# Altium project EV76_MB.PrjPcb
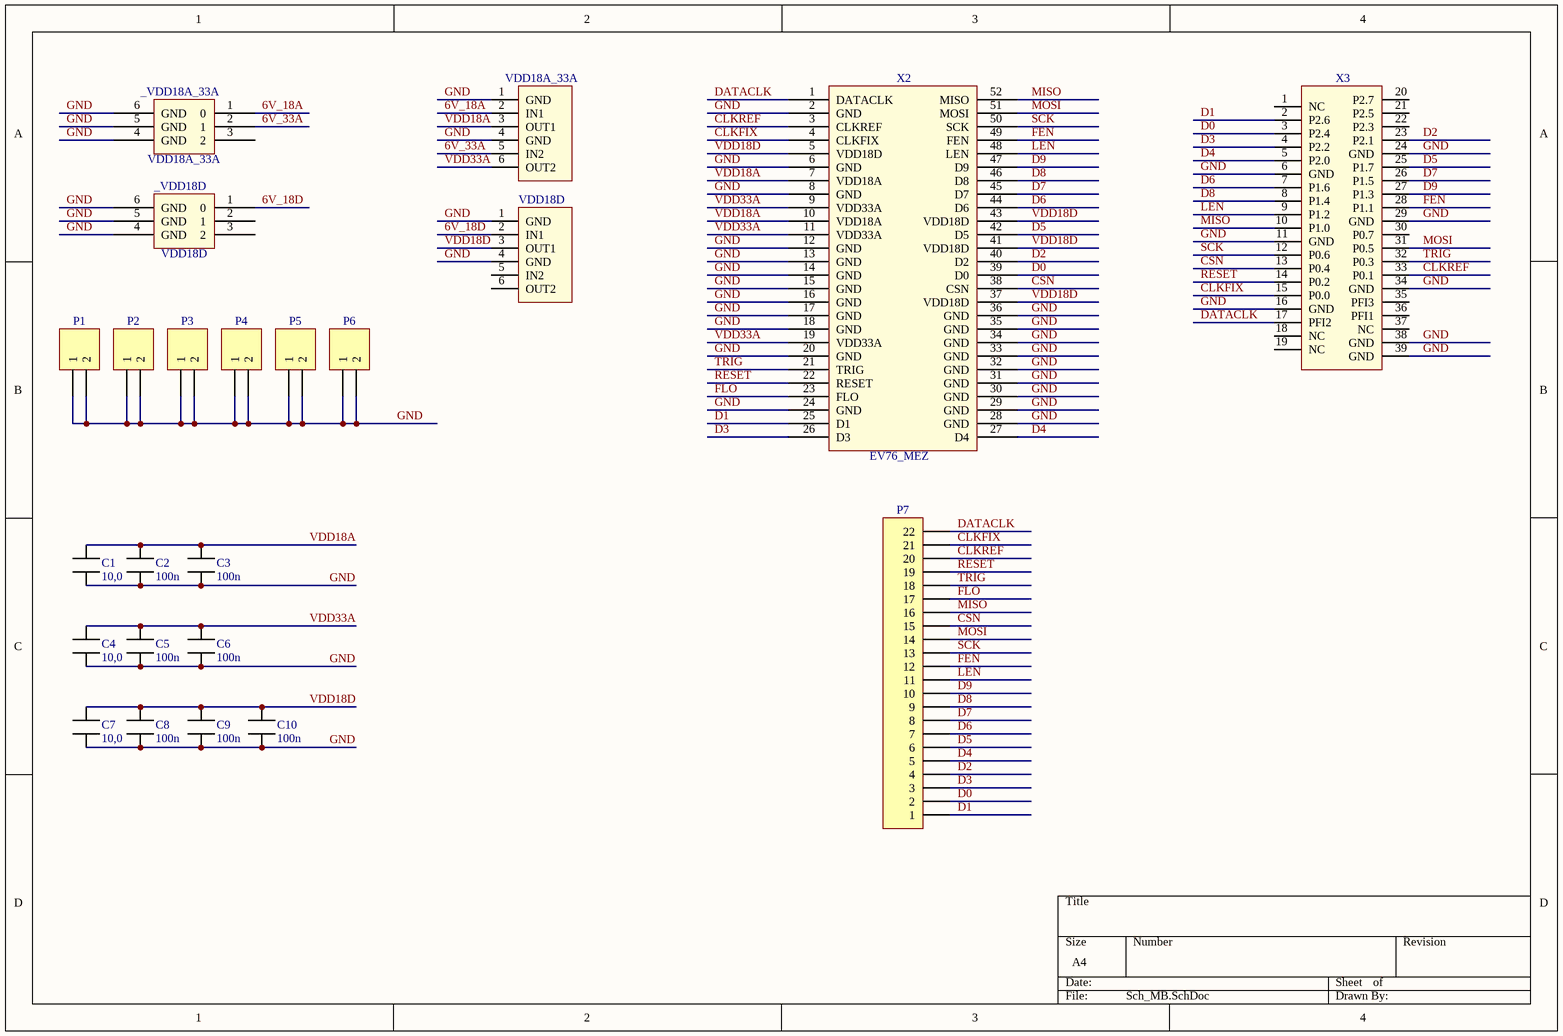
[diagram p0: Sch_MB.SchDoc]
1 sheet, 23 parts. Net scope: global (net labels, ports and power ports of the same name join across sheets).
Board file: PCB_MB.PcbDoc

## Sheet Sch_MB.SchDoc
size A4

### Parts
_VDD18A_33A  VDD18A_33A  [POWER]
_VDD18D  VDD18D  [POWER]
C1  10,0  [Cap_BIG]
C2  100n  [CAP_SMALL]
C3  100n  [CAP_SMALL]
C4  10,0  [Cap_BIG]
C5  100n  [CAP_SMALL]
C6  100n  [CAP_SMALL]
C7  10,0  [Cap_BIG]
C8  100n  [CAP_SMALL]
C9  100n  [CAP_SMALL]
C10  100n  [CAP_SMALL]
P1  Header 2  [HDR1X2]  (value not drawn)
P2  Header 2  [HDR1X2]  (value not drawn)
P3  Header 2  [HDR1X2]  (value not drawn)
P4  Header 2  [HDR1X2]  (value not drawn)
P5  Header 2  [HDR1X2]  (value not drawn)
P6  Header 2  [HDR1X2]  (value not drawn)
P7  Header 22  [HDR1X22]  (value not drawn)
VDD18A_33A  VDD18A_33A  [MEZON_POWER_NEW]  (value not drawn)
VDD18D  VDD18D  [MEZON_POWER_NEW]  (value not drawn)
X2  EV76_MEZ  [EV76C661_MEZONINE]
X3  CHEAP_CON_37_FEMALE  [CHEAP_CONN_FEMALE]  (value not drawn)

### Nets
6V_18A: _VDD18A_33A.1(0) VDD18A_33A.2(IN1)
6V_18D: _VDD18D.1(0) VDD18D.2(IN1)
6V_33A: _VDD18A_33A.2(1) VDD18A_33A.5(IN2)
CLKFIX: P7.21 X2.4(CLKFIX) X3.15(P0.0)
CLKREF: P7.20 X2.3(CLKREF) X3.33(P0.1)
CSN: P7.15 X2.38(CSN) X3.13(P0.4)
D0: P7.2 X2.39(D0) X3.3(P2.4)
D1: P7.1 X2.25(D1) X3.2(P2.6)
D2: P7.4 X2.40(D2) X3.23(P2.1)
D3: P7.3 X2.26(D3) X3.4(P2.2)
D4: P7.5 X2.27(D4) X3.5(P2.0)
D5: P7.6 X2.42(D5) X3.25(P1.7)
D6: P7.7 X2.44(D6) X3.7(P1.6)
D7: P7.8 X2.45(D7) X3.26(P1.5)
D8: P7.9 X2.46(D8) X3.8(P1.4)
D9: P7.10 X2.47(D9) X3.27(P1.3)
DATACLK: P7.22 X2.1(DATACLK) X3.17(PFI2)
FEN: P7.12 X2.49(FEN) X3.28(P1.1)
FLO: P7.17 X2.23(FLO)
GND: _VDD18A_33A.4(GND) _VDD18A_33A.5(GND) _VDD18A_33A.6(GND) _VDD18D.4(GND) _VDD18D.5(GND) _VDD18D.6(GND) C1.1 C2.1 C3.1 C4.1 C5.1 C6.1 C7.1 C8.1 C9.1 C10.1 P1.1 P1.2 P2.1 P2.2 P3.1 P3.2 P4.1 P4.2 P5.1 P5.2 P6.1 P6.2 VDD18A_33A.1(GND) VDD18A_33A.4(GND) VDD18D.1(GND) VDD18D.4(GND) X2.2(GND) X2.6(GND) X2.8(GND) X2.12(GND) X2.13(GND) X2.14(GND) X2.15(GND) X2.16(GND) X2.17(GND) X2.18(GND) X2.20(GND) X2.24(GND) X2.28(GND) X2.29(GND) X2.30(GND) X2.31(GND) X2.32(GND) X2.33(GND) X2.34(GND) X2.35(GND) X2.36(GND) X3.6(GND) X3.11(GND) X3.16(GND) X3.24(GND) X3.29(GND) X3.34(GND) X3.38(GND) X3.39(GND)
LEN: P7.11 X2.48(LEN) X3.9(P1.2)
MISO: P7.16 X2.52(MISO) X3.10(P1.0)
MOSI: P7.14 X2.51(MOSI) X3.31(P0.5)
RESET: P7.19 X2.22(RESET) X3.14(P0.2)
SCK: P7.13 X2.50(SCK) X3.12(P0.6)
TRIG: P7.18 X2.21(TRIG) X3.32(P0.3)
VDD18A: C1.2 C2.2 C3.2 VDD18A_33A.3(OUT1) X2.7(VDD18A) X2.10(VDD18A)
VDD18D: C7.2 C8.2 C9.2 C10.2 VDD18D.3(OUT1) X2.5(VDD18D) X2.37(VDD18D) X2.41(VDD18D) X2.43(VDD18D)
VDD33A: C4.2 C5.2 C6.2 VDD18A_33A.6(OUT2) X2.9(VDD33A) X2.11(VDD33A) X2.19(VDD33A)

Not connected (* = marked no-connect by the designer): _VDD18A_33A 3(2); _VDD18D 2(1) 3(2); VDD18D 5(IN2) 6(OUT2); X3 1(NC) 18(NC) 19(NC) 20(P2.7) 21(P2.5) 22(P2.3) 30(P0.7) 35(PFI3) 36(PFI1) 37(NC)

### Library data of the parts
_VDD18A_33A _VDD18D = POWER
C1 C4 C7 = CAP_BIG
C2 C3 C5 C6 C8-C10 = CAP_SMALL
P1-P6 = Header 2: Header, 2-Pin; LatestRevisionDate: 17-Jul-2002; LatestRevisionNote: Re-released for DXP Platform.; Publisher: Altium Limited
P7 = Header 22: Header, 22-Pin; LatestRevisionDate: 17-Jul-2002; LatestRevisionNote: Re-released for DXP Platform.; Publisher: Altium Limited
VDD18A_33A VDD18D = MEZON_POWER_NEW
X2 = EV76C661_MEZ